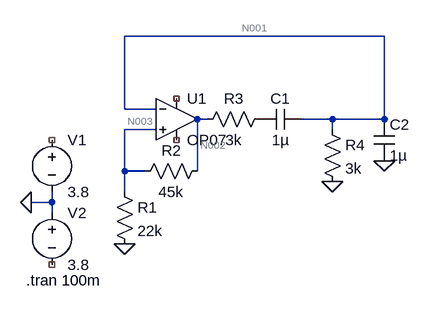
[diagram p0: schematic Draft9.asc]
Draft9.asc, the LTspice schematic file:
Version 4
SHEET 1 880 680
WIRE 560 0 160 0
WIRE 160 112 160 0
WIRE 208 112 160 112
WIRE 288 128 272 128
WIRE 480 128 432 128
WIRE 560 128 560 0
WIRE 560 128 480 128
WIRE 208 144 160 144
WIRE 480 144 480 128
WIRE 160 208 160 144
WIRE 192 208 160 208
WIRE 272 208 272 128
WIRE 160 240 160 208
WIRE 48 256 48 240
WIRE 48 256 16 256
WIRE 48 272 48 256
FLAG 480 224 0
FLAG 560 192 0
FLAG 160 320 0
FLAG 16 256 0
SYMBOL OpAmps\\OP07 240 64 R0
SYMATTR InstName U1
SYMBOL voltage 48 144 R0
WINDOW 123 0 0 Left 0
WINDOW 39 0 0 Left 0
SYMATTR InstName V1
SYMATTR Value 3.8
SYMBOL voltage 48 256 R0
WINDOW 123 0 0 Left 0
WINDOW 39 0 0 Left 0
SYMATTR InstName V2
SYMATTR Value 3.8
SYMBOL res 144 224 R0
SYMATTR InstName R1
SYMATTR Value 22k
SYMBOL res 288 192 R90
WINDOW 0 0 56 VBottom 2
WINDOW 3 32 56 VTop 2
SYMATTR InstName R2
SYMATTR Value 45k
SYMBOL res 384 112 R90
WINDOW 0 0 56 VBottom 2
WINDOW 3 32 56 VTop 2
SYMATTR InstName R3
SYMATTR Value 3k
SYMBOL cap 432 112 R90
WINDOW 0 0 32 VBottom 2
WINDOW 3 32 32 VTop 2
SYMATTR InstName C1
SYMATTR Value 1µ
SYMBOL res 464 128 R0
SYMATTR InstName R4
SYMATTR Value 3k
SYMBOL cap 544 128 R0
SYMATTR InstName C2
SYMATTR Value 1µ
TEXT 8 376 Left 2 !.tran 100m

The netlist it stands for:
* Draft9.asc
XU1 N003 N001 NC_01 NC_02 N002 LT1001  ; OP07, pins In+ In- V+ V- OUT
V1 NC_03 0 3.8
V2 0 NC_04 3.8
R1 N003 0 22k
R2 N002 N003 45k
R3 P001 N002 3k
C1 N001 P001 1µ
R4 N001 0 3k
C2 N001 0 1µ
.tran 100m
.lib LTC.lib
.backanno
.end

* Results of the author's LTspice run, read from the files saved beside the schematic
* Operating Point, zero values left out:
*   V(n001) = 134.2 nV
*   V(n003) = 3.297 mV
*   V(n002) = 10.04 mV
*   V(p001) = 10.04 mV
*   I(R1) = 149.9 nA
*   I(R2) = 149.9 nA
*   I(R4) = 44.73 pA
*   Ix(u1:1) = 44.29 pA
*   Ix(u1:2) = -44.73 pA
*   Ix(u1:5) = -149.9 nA